# Altium schematic sheet Schematic.SchDoc
size A4
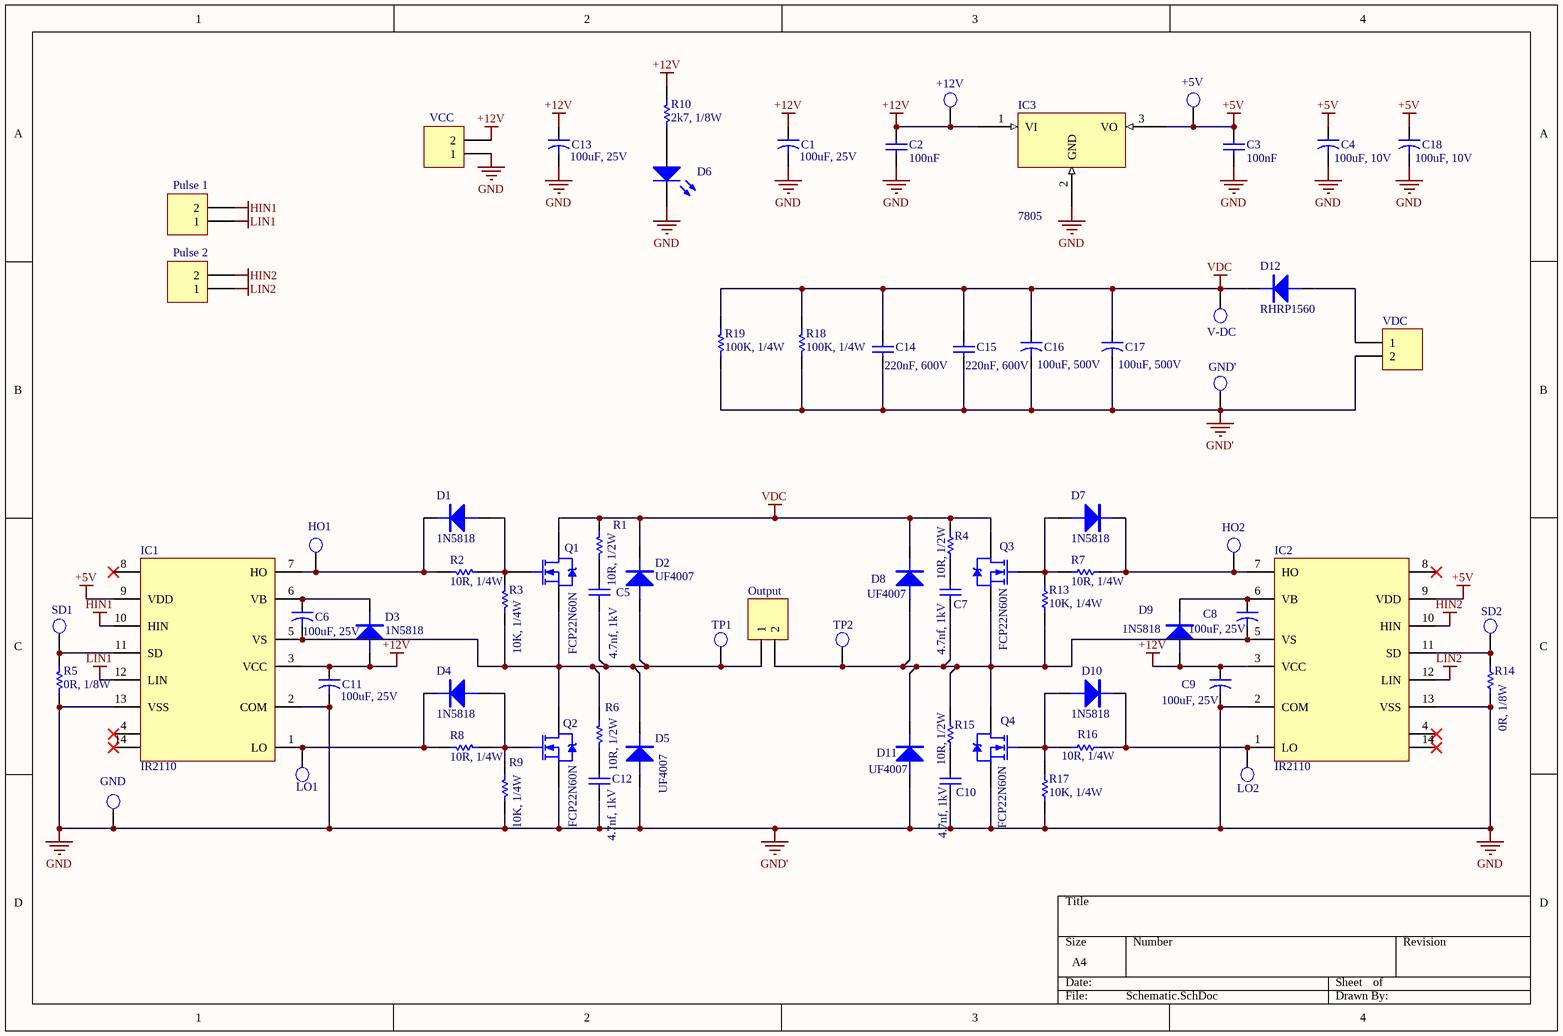
[diagram p0: Schematic.SchDoc]

## Parts
+5V  +5V  [TPTHD_B_WHT]  (value not drawn)
+12V  +12V  [TPTHD_B_WHT]  (value not drawn)
C1  100uF, 25V  [C_EL_6X11]
C2  100nF  [C_PLY_6X2_5]
C3  100nF  [C_PLY_6X2_5]
C4  100uF, 10V  [C_EL_5X11]
C5  4.7nf, 1kV  [RAD0.2-1]
C6  100uF, 25V  [C_EL_6X11]
C7  4.7nf, 1kV  [RAD0.2-1]
C8  100uF, 25V  [C_EL_6X11]
C9  100uF, 25V  [C_EL_6X11]
C10  4.7nf, 1kV  [RAD0.2-1]
C11  100uF, 25V  [C_EL_6X11]
C12  4.7nf, 1kV  [RAD0.2-1]
C13  100uF, 25V  [C_EL_6X11]
C14  220nF, 600V  [CAP-pitch15]
C15  220nF, 600V  [CAP-pitch15]
C16  100uF, 500V  [C_EL_18X35]
C17  100uF, 500V  [C_EL_18X35]
C18  100uF, 10V  [C_EL_5X11]
D1  1N5818  [D_AX04_DO41]
D2  UF4007  [D_AX04_DO41]
D3  1N5818  [D_AX04_DO41]
D4  1N5818  [D_AX04_DO41]
D5  UF4007  [D_AX04_DO41]
D6  LED RED  [LED3MM]  (value not drawn)
D7  1N5818  [D_AX04_DO41]
D8  UF4007  [D_AX04_DO41]
D9  1N5818  [D_AX04_DO41]
D10  1N5818  [D_AX04_DO41]
D11  UF4007  [D_AX04_DO41]
D12  RHRP1560  [TO220_21]
GND  GND  [TPTHD_B_WHT]  (value not drawn)
GND'  HO  [TPTHD_B_WHT]  (value not drawn)
HO1  HO  [TPTHD_B_WHT]  (value not drawn)
HO2  HO  [TPTHD_B_WHT]  (value not drawn)
IC1  IR2110  [DIP_14]
IC2  IR2110  [DIP_14]
IC3  7805  [TO220_3]
LO1  LO  [TPTHD_B_WHT]  (value not drawn)
LO2  LO  [TPTHD_B_WHT]  (value not drawn)
Output  Output  [TBG_2]  (value not drawn)
Pulse_1  (no value)  [TBG_2]
Pulse_2  (no value)  [TBG_2]
Q1  FCP22N60N  [TO220_32]
Q2  FCP22N60N  [TO220_32]
Q3  FCP22N60N  [TO220_32]
Q4  FCP22N60N  [TO220_32]
R1  10R, 1/2W  [R05W_AX05]
R2  10R, 1/4W  [R025W_AX04]
R3  10K, 1/4W  [R025W_AX04]
R4  10R, 1/2W  [R05W_AX05]
R5  0R, 1/8W  [R0125W_AX025]
R6  10R, 1/2W  [R05W_AX05]
R7  10R, 1/4W  [R025W_AX04]
R8  10R, 1/4W  [R025W_AX04]
R9  10K, 1/4W  [R025W_AX04]
R10  2k7, 1/8W  [R0125W_AX025]
R13  10K, 1/4W  [R025W_AX04]
R14  0R, 1/8W  [R0125W_AX025]
R15  10R, 1/2W  [R05W_AX05]
R16  10R, 1/4W  [R025W_AX04]
R17  10K, 1/4W  [R025W_AX04]
R18  100K, 1/4W  [R025W_AX04]
R19  100K, 1/4W  [R025W_AX04]
SD1  SD  [TPTHD_B_WHT]  (value not drawn)
SD2  SD  [TPTHD_B_WHT]  (value not drawn)
TP1  HO  [TPTHD_B_WHT]  (value not drawn)
TP2  HO  [TPTHD_B_WHT]  (value not drawn)
V-DC  HO  [TPTHD_B_WHT]  (value not drawn)
VCC  (no value)  [TBG_2]
VDC  (no value)  [TBG_2]

## Nets
+5V: +5V.1 C3.2 C4.1 C18.1 IC1.9(VDD) IC2.9(VDD) IC3.3(VO)
+12V: +12V.1 C1.1 C2.2 C9.1 C11.1 C13.1 D3.1 D9.1 IC1.3(VCC) IC2.3(VCC) IC3.1(VI) R10.1 VCC.2
GND: C1.2 C2.1 C3.1 C4.2 C9.2 C10.2 C11.2 C12.2 C13.2 C14.2 C15.2 C16.2 C17.2 C18.2 D5.1 D6.2(K) D11.1 GND.1 GND'.1 IC1.2(COM) IC1.13(VSS) IC2.2(COM) IC2.13(VSS) IC3.2(GND) Q2.3(S) Q4.3(S) R5.1 R9.2 R14.1 R17.2 R18.1 R19.1 VCC.1 VDC.2  [also labelled GND']
HIN1: IC1.10(HIN) Pulse_1.2
HIN2: IC2.10(HIN) Pulse_2.2
LIN1: IC1.12(LIN) Pulse_1.1
LIN2: IC2.12(LIN) Pulse_2.1
VDC: C14.1 C15.1 C16.1 C17.1 D2.2 D8.2 D12.1 Q1.2(D) Q3.2(D) R1.1 R4.1 R18.2 R19.2 V-DC.1
NetC5_1: C5.1 R1.2
NetC5_2: C5.2 C6.2 D2.1 D5.2 IC1.5(VS) Output.1 Q1.3(S) Q2.2(D) R3.2 R6.1 TP1.1
NetC6_1: C6.1 D3.2 IC1.6(VB)
NetC7_1: C7.1 R4.2
NetC7_2: C7.2 C8.2 D8.1 D11.2 IC2.5(VS) Output.2 Q3.3(S) Q4.2(D) R13.2 R15.1 TP2.1
NetC8_1: C8.1 D9.2 IC2.6(VB)
NetC10_1: C10.1 R15.2
NetC12_1: C12.1 R6.2
NetD1_1: D1.1 Q1.1(G) R2.2 R3.1
NetD1_2: D1.2 HO1.1 IC1.7(HO) R2.1
NetD4_1: D4.1 Q2.1(G) R8.2 R9.1
NetD4_2: D4.2 IC1.1(LO) LO1.1 R8.1
NetD6_1: D6.1(A) R10.2
NetD7_1: D7.1 Q3.1(G) R7.2 R13.1
NetD7_2: D7.2 HO2.1 IC2.7(HO) R7.1
NetD10_1: D10.1 Q4.1(G) R16.2 R17.1
NetD10_2: D10.2 IC2.1(LO) LO2.1 R16.1
NetD12_2: D12.2 VDC.1
NetIC1_11: IC1.11(SD) R5.2 SD1.1
NetIC2_11: IC2.11(SD) R14.2 SD2.1

Not connected (* = marked no-connect by the designer): IC1 4* 8* 14*; IC2 4* 8* 14*

## Library data of the parts
+5V +12V GND GND' HO1 HO2 LO1 LO2 SD1 SD2 TP1 TP2 V-DC = TP
C1 C4 C6 C8 C9 C11 C13 C18 = Cap2: 200V, 330uF; Category: Capacitor; Mounting Style: Through hole
  C1 C6 C8 C9 C11 C13: Part Number: 100uF, 25V
  C4 C18: Part Number: 100uF, 10V
C2 C3 = Cap: Capacitor; Layer: Top; Category: Capacitor; Mounting Style: SMD; Package: 0603
C5 C7 C10 C12 C14 C15 = Cap: Category: Capacitor; Mounting Style: Through hole
  C5 C7 C10 C12: Part Number: 4.7nf, 1kV
  C14 C15: Part Number: 220nF, 600V
C16 C17 = Cap2: 500HXW100MEFR18X40; Category: Capacitor; Mounting Style: Through hole; Part Number: 100uF, 500V
D1-D5 D7-D11 = DIODE5: MAnufacturer: Comchip Technology; Category: Diode; Mounting Style: Through hole; Package: DO-15
  D1 D3 D4 D7 D9 D10: Part Number: 1N5818
  D2 D5 D8 D11: Part Number: UF4007
D6 = LED0: Typical INFRARED GaAs LED; Layer: Top; Category: LED; Mounting Style: Through Hole
D12 = DIODE5: Category: Diode; Mounting Style: Through hole; Part Number: RHRP1560
IC3 = 7805: Text Field1: 80; Text Field2: 40
Output Pulse_1 Pulse_2 VCC VDC = Header 2: Header, 2-Pin
  Output: Part Number: Output
Q1-Q4 = NMOS-2: N-Channel Power MOSFET; Category: transistor; Package: TO-247; Part Number: FCP22N60N
R1-R10 R13-R19 = Res1: Resistor; Category: Resistor; Mounting Style: Through hole
  R1 R4 R6 R15: Part Number: 10R, 1/2W
  R2 R7 R8 R16: Part Number: 10R, 1/4W
  R3 R9 R13 R17: Part Number: 10K, 1/4W
  R5 R14: Part Number: 0R, 1/8W
  R10: Part Number: 2k7, 1/8W
  R18 R19: Part Number: 100K, 1/4W